# Altium schematic sheet motordriver-v5.0_isolation-general.SchDoc
size A4; SheetNumber: 3; SheetTotal: 10
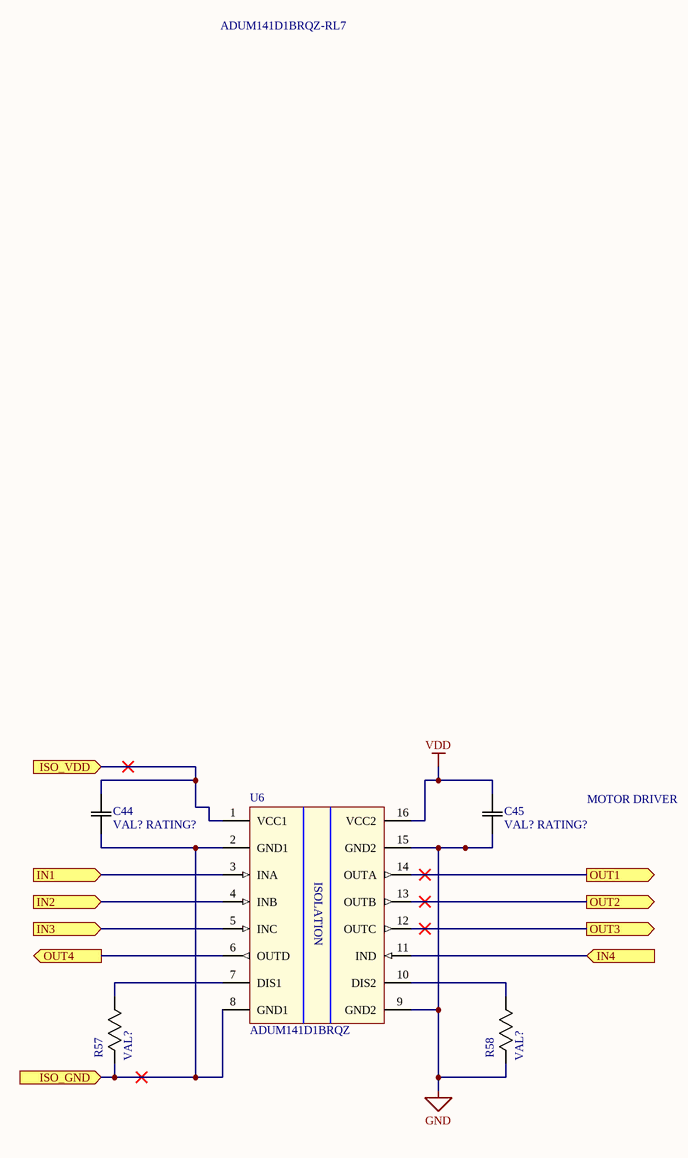
[diagram p0: motordriver-v5.0_isolation-general.SchDoc]

## Parts
C44  VAL? RATING?  [0603]
C45  VAL? RATING?  [0603]
R57  VAL?  [0603]
R58  VAL?  [0603]
U6  ADUM141D1BRQZ  Supplier Part Number 1: ADUM141D1BRQZ-RL7  [SOP64P600X175-16N]

## Ports
IN1 (in), IN2 (in), IN3 (in), IN4 (in), ISO_GND (in), ISO_VDD (in), OUT1 (out), OUT2 (out), OUT3 (out), OUT4 (out)

## Nets
GND: C45.1(C1) R58.2(R2) U6.9(GND2) U6.15(GND2)
VDD: C45.2(C2) U6.16(VCC2)
IN1: U6.3(INA) ; port IN1
IN2: U6.4(INB) ; port IN2
IN3: U6.5(INC) ; port IN3
IN4: U6.11(IND) ; port IN4
ISO_GND: C44.1(C1) R57.2(R2) U6.2(GND1) U6.8(GND1) ; port ISO_GND
ISO_VDD: C44.2(C2) U6.1(VCC1) ; port ISO_VDD
OUT1: U6.14(OUTA) ; port OUT1
OUT2: U6.13(OUTB) ; port OUT2
OUT3: U6.12(OUTC) ; port OUT3
OUT4: U6.6(OUTD) ; port OUT4
NetR57_1: R57.1(R1) U6.7(DIS1)
NetR58_1: R58.1(R1) U6.10(DIS2)

## Notes on the sheet
- MOTOR DRIVER
- (in symbol ISO ADUM141D1BRQZ) ISOLATION

## Library data of the parts
C44 C45 = CAP 100nF 50V: Default Symbol for Capacitors; Manufacturer Part Number 1: CC0603KPX7R9BB104; Value: 100nF; Rating: 50V; Temperature Coefficient: X7R; Tolerance: 10%; Part Number: CAP 100nF 50V; Supplier 1: Digi-Key; Supplier Part Number 1: 311-3567-1-ND; Manufacturer Part Number 2: 0805J0500104KJT; Supplier 2: Digi-Key; Supplier Part Number 2: 1608-1458-1-ND
R57 R58 = RES 4.7k 1/8W - 5%: Default Resistor Symbol; Value: 1; Power (Watts): 0.125W; Tolerance: 5%; Package: 0805; Part Number: RES 4.7k 1/8W - 5%
U6 = ISO ADUM141D1BRQZ: Digital Isolator CMOS 4-CH 150Mbps 16-Pin QSOP T/R; Manufacturer: Analog Devices; Isolated Power: No; Number of Channels: 4; Channel Type: Unidirectional; Propagation Delay: 13ns; Pulse Width Distortion (PWD): 3ns; Supplier 1: Arrow Electronics; Manufacturer Part Number: ADUM141D1BRQZ-RL7; RoHS: Yes; Category: Interface ICs; Stock 1: 341; Pricing 1: 1=3.87700, 10=3.47000, 25=3.26100, 50=3.22900, 100=2.78500, 250=2.67500 (USD); Mount: Surface Mount; Case/Package: SSOP; Number of Pins: 16; Min Operating Temperature: -40°C; Max Operating Temperature: 125°C; Type: General Purpose; Packaging: Tape and Reel; Data Rate: 150Mbps; RoHS Compliant: Yes; ComponentLink1URL: https://www.analog.com/media/en/technical-documentation/data-sheets/ADuM140D_140E_141D_141E_142D_142E.pdf?src-supplier=Digi-Key; ComponentLink1Description: https://www.analog.com/media/en/technical-documentation/data-sheets/ADuM140D_140E_141D_141E_142D_142E.pdf?src-supplier=Digi-Key